# EAGLE design card (EAGLE 6.4)

## Sheet 1 of 2
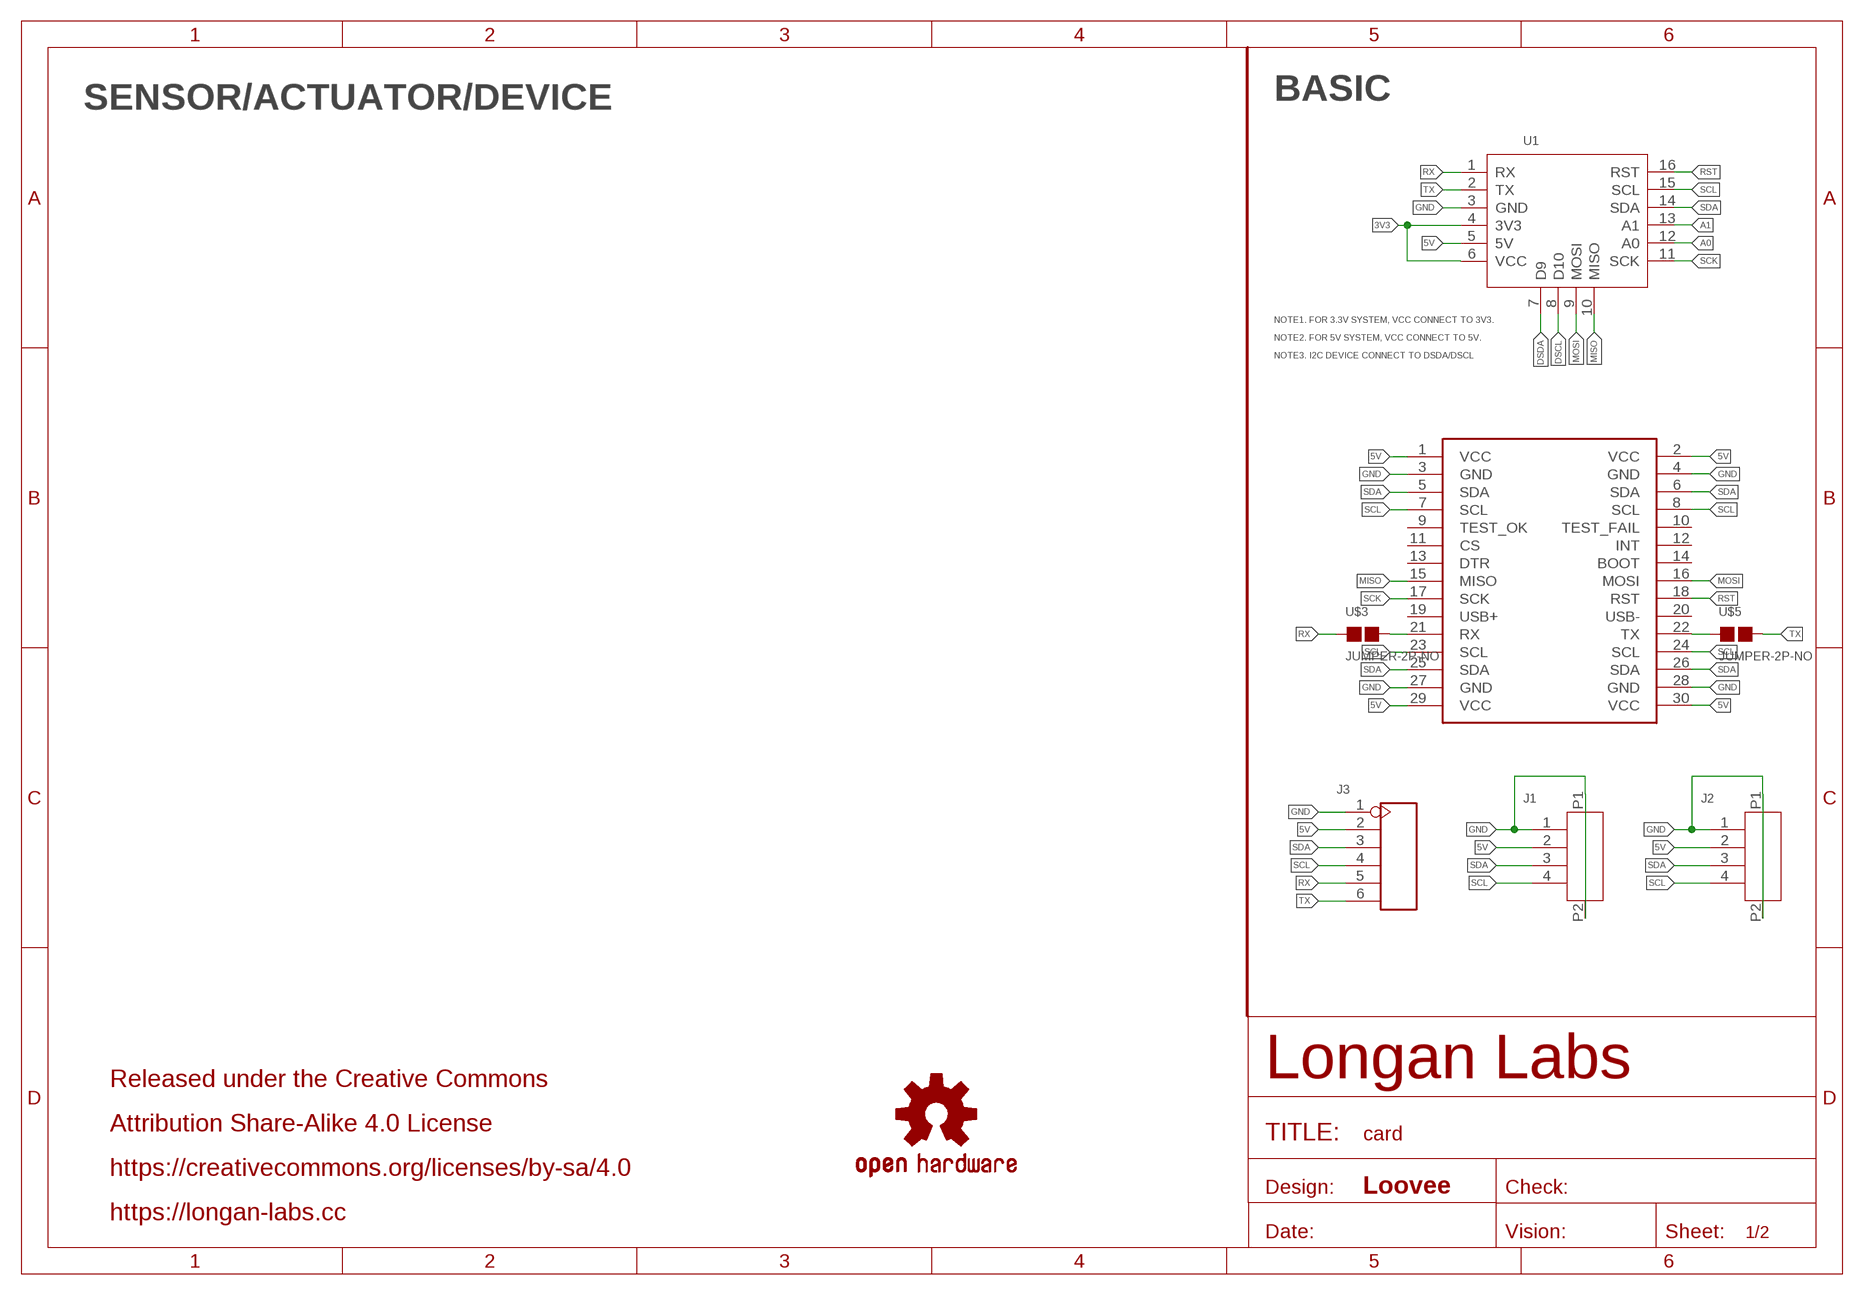
[diagram p0: schematic, sheet 1]

### Parts
J1  HEADER-4P-1.0  [4P-1.0-90D]
J2  HEADER-4P-1.0  [4P-1.0-90D]
J3  HEADER-6P-55/35MIL  [H6-2.54]
LOGO2  OSHW-LOGOS  [OSHW-LOGO-S]
MOUDLE1  MOUDLE-2X15P-2.54'BOARD'  [MOUDLE-2X15P-2.54]
U1  MOUDLE-CARDS  [16P-2.0-CARDS]
U$3  JUMPER-2P-NO  [2P-SMD-NO]
U$5  JUMPER-2P-NO  [2P-SMD-NO]

### Nets
3V3: U1.4(3V3) U1.6(VCC)
5V: J1.2 J2.2 J3.2 MOUDLE1.1(VCC) MOUDLE1.2(VCC) MOUDLE1.29(VCC) MOUDLE1.30(VCC) U1.5(5V)
A0: U1.12(A0)
A1: U1.13(A1)
DSCL: U1.8(D10)
DSDA: U1.7(D9)
GND: J1.1 J1.P1 J1.P2 J2.1 J2.P1 J2.P2 J3.1 MOUDLE1.3(GND) MOUDLE1.4(GND) MOUDLE1.27(GND) MOUDLE1.28(GND) U1.3(GND)
MISO: MOUDLE1.15(MISO) U1.10(MISO)
MOSI: MOUDLE1.16(MOSI) U1.9(MOSI)
N$1: MOUDLE1.21(RX) U$3.2
N$2: MOUDLE1.22(TX) U$5.1
RST: MOUDLE1.18(RST) U1.16(RST)
RX: J3.5 U1.1(RX) U$3.1
SCK: MOUDLE1.17(SCK) U1.11(SCK)
SCL: J1.4 J2.4 J3.4 MOUDLE1.7(SCL) MOUDLE1.8(SCL) MOUDLE1.23(SCL) MOUDLE1.24(SCL) U1.15(SCL)
SDA: J1.3 J2.3 J3.3 MOUDLE1.5(SDA) MOUDLE1.6(SDA) MOUDLE1.25(SDA) MOUDLE1.26(SDA) U1.14(SDA)
TX: J3.6 U1.2(TX) U$5.2
Unconnected: MOUDLE1.9(TEST_OK) MOUDLE1.10(TEST_FAIL) MOUDLE1.11(CS) MOUDLE1.12(INT) MOUDLE1.13(DTR) MOUDLE1.14(BOOT) MOUDLE1.19(USB+) MOUDLE1.20(USB-)

### Notes on the sheet
- SENSOR/ACTUATOR/DEVICE | BASIC
- NOTE1. FOR 3.3V SYSTEM, VCC CONNECT TO 3V3.
- NOTE2. FOR 5V SYSTEM, VCC CONNECT TO 5V.
- NOTE3. I2C DEVICE CONNECT TO DSDA/DSCL
- Released under the Creative Commons
- Attribution Share-Alike 4.0 License
- https://creativecommons.org/licenses/by-sa/4.0
- Loovee
- https://longan-labs.cc

## Sheet 2 of 2

## Library data of the parts
J1 J2 = Longan-Connect:HEADER-4P-1.0
J3 = Connector-new:HEADER-6P
LOGO2 = SparkFun-Aesthetics:OSHW-LOGO: Open-Source Hardware (OSHW) Logo This logo indicates the piece of hardware it is found on incorporates a OSHW license and/or adheres to the definition of open source hardware found here: http://freedomdefined.org/OSHW
MOUDLE1 = Longan-moudle:MOUDLE-2X15P-2.54
U1 = MOUDLE-CARDS:MOUDLE-CARDS
U$3 U$5 = Discrete-new:JUMPER-2P-NO

## Board
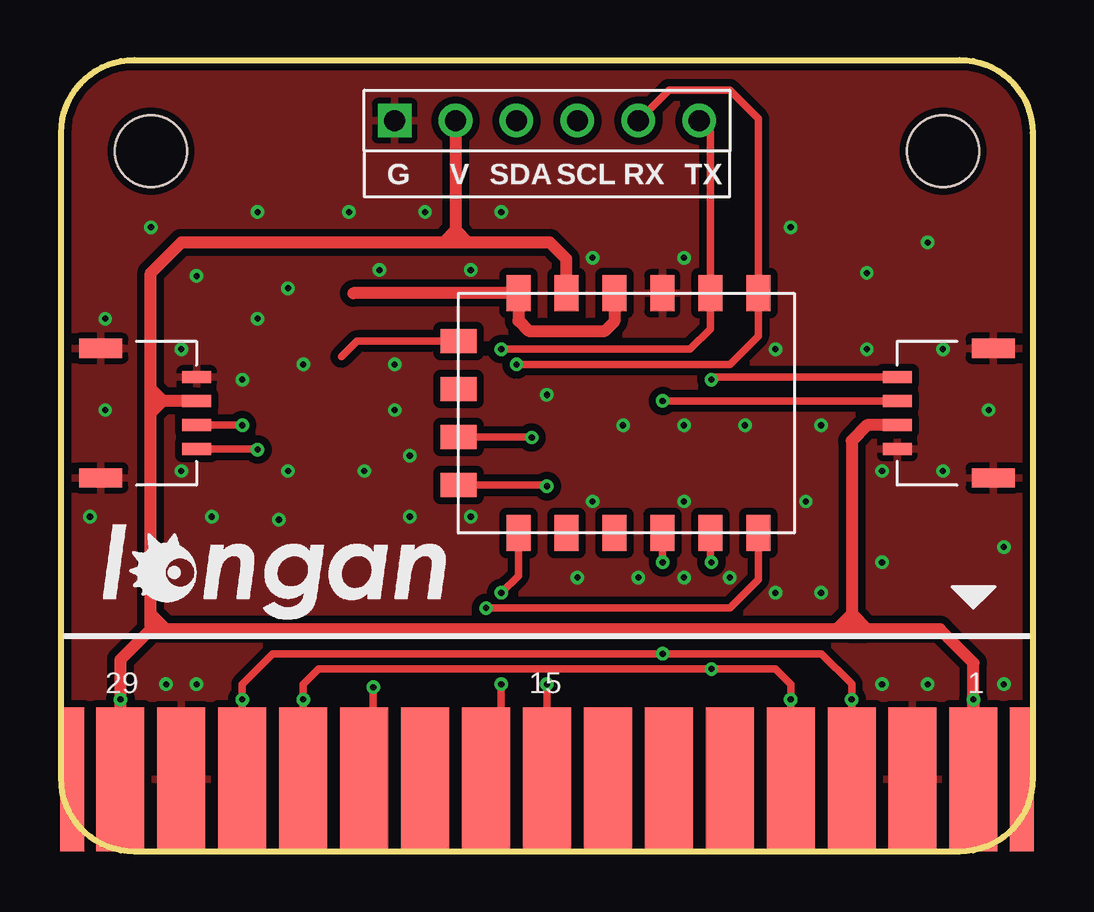
[diagram p1: board, top side]
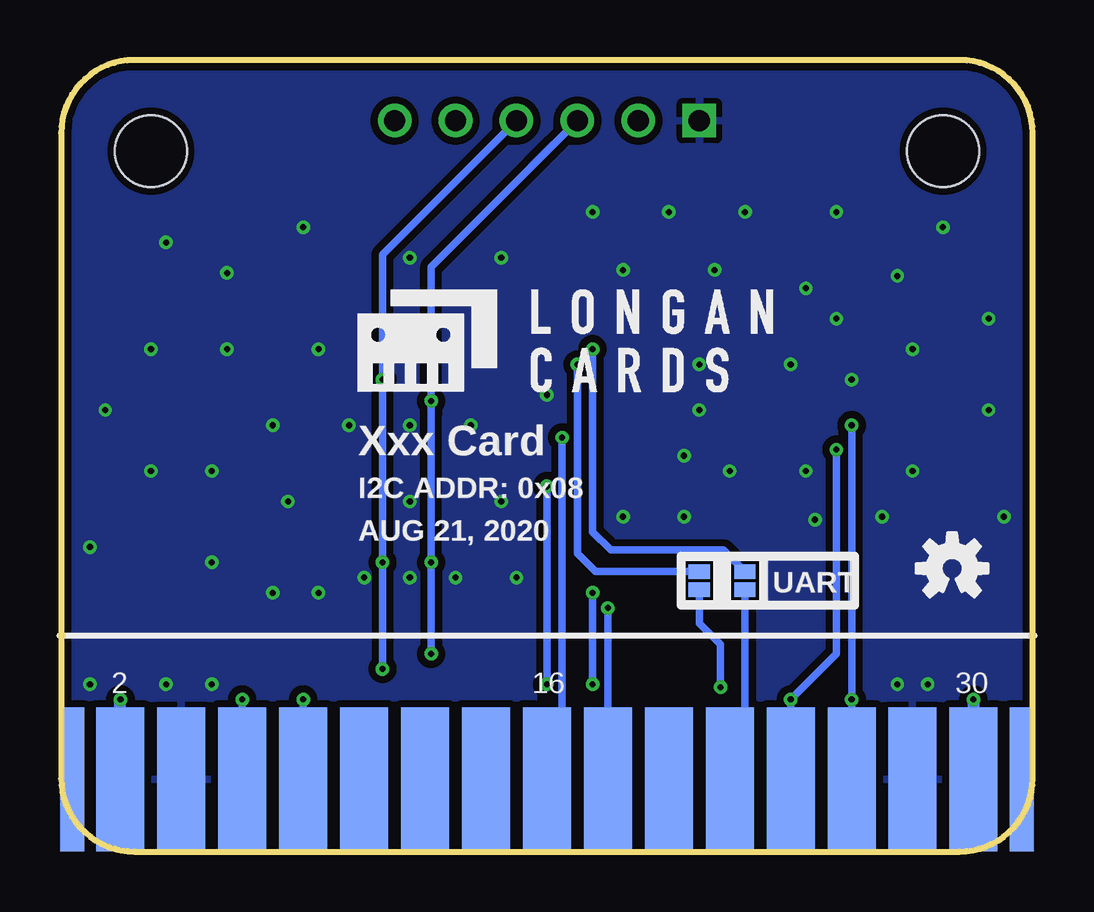
[diagram p2: board, bottom side, seen from below]

Size 40.5 x 33 mm. Coordinates in mm from the lower left corner, seen from the top.
Copper layers (1*16): Top 0.035mm / dielectric 1.5mm / Bottom 0.035mm
Design rules "SeeedStudio_2layer_DRU_no_angle_20140221 *": minimum track width 6mil, minimum drill 10mil, track to track 6mil, track to pad 6mil, pad to pad 6mil, via to via 6mil, smd to smd 0mil, copper to edge 10mil, drill to drill 10mil, minimum pad ring 10mil, minimum via ring 6mil, stop-mask expansion 2mil, vias tented up to drill 25mil, thermal gap 10mil

### Footprints (pad centres in the part's own frame; a part is rotated, then mirrored left to right if it is on the bottom)
4P-1.0-90D = smd 1.2 x 0.5: 1 0,1.5; 2 0,0.5; 3 0,-0.5; 4 0,-1.5 | smd 1.8 x 0.8: P1 -4,2.7; P2 -4,-2.7
H6-2.54 = drill 0.889 pad 1.397 square: 1 0,6.35 | drill 0.889 pad 1.397: 2 0,3.81; 3 0,1.27; 4 0,-1.27; 5 0,-3.81; 6 0,-6.35
MOUDLE-2X15P-2.54 = smd 2 x 6: 1 17.78,-13.492; 3 15.24,-13.492; 5 12.7,-13.492; 7 10.16,-13.492; 9 7.62,-13.492; 11 5.08,-13.492; 13 2.54,-13.492; 15 0,-13.492; 17 -2.54,-13.492; 19 -5.08,-13.492; 21 -7.62,-13.492; 23 -10.16,-13.492; 25 -12.7,-13.492; 27 -15.24,-13.492; 29 -17.78,-13.492 | smd 2 x 6 bottom: 2 17.78,-13.492; 4 15.24,-13.492; 6 12.7,-13.492; 8 10.16,-13.492; 10 7.62,-13.492; 12 5.08,-13.492; 14 2.54,-13.492; 16 0,-13.492; 18 -2.54,-13.492; 20 -5.08,-13.492; 22 -7.62,-13.492; 24 -10.16,-13.492; 26 -12.7,-13.492; 28 -15.24,-13.492; 30 -17.78,-13.492 | smd 1 x 6: P1 -19.8,-13.492; P4 19.8,-13.492 | smd 1 x 6 bottom: P2 -19.8,-13.492; P3 19.8,-13.492 | hole 3: -16.51,12.7; 16.51,12.7
16P-2.0-CARDS = smd 1.5 x 1: 1 -5,5; 2 -5,3; 3 -5,1; 4 -5,-1; 5 -5,-3; 6 -5,-5; 11 5,-5; 12 5,-3; 13 5,-1; 14 5,1; 15 5,3; 16 5,5 | smd 1 x 1.5: 7 -3,-7.5; 8 -1,-7.5; 9 1,-7.5; 10 3,-7.5
2P-SMD-NO = smd 0.889 x 0.61: 1 0,0.381; 2 0,-0.381

### Placement (x,y rotation side)
J1  5.64,18.28 0 top
J2  34.86,18.28 180 top
J3  20.25,30.47 90 top
LOGO2  3.36,11.8 0 bottom
MOUDLE1  20.25,16.5 0 top
U1  24.06,18.28 270 top
U$1  [LONGAN-CARDS-MIDDLE]  28.89,18.66 0 bottom
U$2  [LONGAN-SILK-SMALLER]  0.44,8.5 0 top
U$3  13.9,11.29 0 bottom
U$5  11.99,11.29 180 bottom

### Tracks (layer width: path | path; a pad name or v marks a point on that pad's centre or on a via)
3V3
  Top 0.508: 12.17,23.28 U1.6 19.06,22.13 19.49,21.71 22.66,21.71 23.06,22.1 U1.4
5V  (via drill 0.25 pad 0.51)
  Top 0.508: v38.03,6.34 MOUDLE1.2 38.03,7.86 36.63,9.26 33.59,9.26 | 32.82,9.26 32.31,9.26 | 32.31,9.26 5.01,9.26 4.38,9.26 | 4.38,9.26 3.74,9.26 | 3.74,9.26 2.47,7.99 v2.47,6.34 MOUDLE1.30 | 3.74,9.26 3.74,9.9 | 3.74,9.9 3.74,18.28 | 3.74,18.28 3.74,18.79 | J1.2 4.26,18.78 | 4.24,18.78 3.75,18.78 3.74,18.79 | U1.5 21.06,24.71 20.38,25.39 16.95,25.39 | 16.95,25.39 16.44,25.39 | 16.44,25.39 15.93,25.39 | 15.93,25.39 5.01,25.39 3.74,24.12 3.74,19.29 | 3.74,18.79 3.74,19.29 | J3.2 16.44,25.9 | 16.44,25.9 16.44,25.39 | J2.2 33.59,17.78 32.95,17.14 32.95,9.9 | 32.95,9.9 32.95,9.39 32.82,9.26 | 4.26,18.78 3.74,19.29 | 4.26,18.78 4.24,18.78 | 4.24,18.78 3.74,18.28 | 16.44,25.9 16.95,25.39 | 16.44,25.9 15.93,25.39 | 32.95,9.9 33.59,9.26 | 32.95,9.9 32.31,9.26 | 32.82,9.26 33.59,9.26 | 4.38,9.26 3.74,9.9
  Bottom 0.508: MOUDLE1.2 v38.03,6.34 | v2.47,6.34 MOUDLE1.30
DSDA
  Top 0.305: U1.7 12.33,21.28 11.69,20.63
GND  (via drill 0.25 pad 0.51)
  other vias: 4.38,6.97 5.64,6.97 34.22,6.97 36.12,6.97 21.52,11.42 24.06,11.42 25.96,11.42 27.87,11.42 29.77,10.79 31.68,10.79 38.66,18.41 36.76,15.87 36.76,20.95 31.68,17.77 28.51,17.77 25.96,17.77 23.43,17.77 25.96,14.6 22.16,14.6 31.05,14.6 20.25,19.04 13.9,20.31 12.63,15.87 13.9,18.41 9.46,15.87 9.07,13.83 14.54,13.96 17.07,13.96 14.54,16.5 7.55,19.68 10.09,20.31 17.07,24.25 13.27,24.25 9.46,23.48 8.19,22.21 5.01,20.95 5.01,15.87 1.84,18.41 1.84,22.21 1.2,13.96 6.28,13.96 5.64,23.99 3.74,26.02 8.19,26.66 15.17,26.66 11.99,26.66 18.34,26.66 22.16,24.76 25.96,24.76 29.77,20.95 33.59,20.95 30.41,26.02 36.12,25.39 33.59,24.12 34.22,12.05 39.3,12.69 34.22,15.87 39.3,6.97
  pour Bottom (isolate 0.305): -0.07,33.01 40.57,33.01 40.57,-0.01 -0.07,-0.01
  pour Top (isolate 0.305): -0.07,33.01 40.57,33.01 40.57,-0.01 -0.07,-0.01
MISO  (via drill 0.25 pad 0.51)
  Top 0.305: U1.10 20.2,15.28 v20.25,15.23 | v20.25,6.97 MOUDLE1.15
  Bottom 0.305: v20.25,15.23 v20.25,6.97
MOSI  (via drill 0.25 pad 0.51)
  Top 0.305: U1.9 19.6,17.28 v19.61,17.26
  Bottom 0.305: v19.61,17.26 19.61,3.64 MOUDLE1.16
N$1  (via drill 0.25 pad 0.51)
  Top 0.305: v13.01,6.85 13.01,2.66 12.63,2.28 MOUDLE1.21
  Bottom 0.305: U$3.2 13.9,9.52 13.01,8.63 v13.01,6.85
N$2
  Bottom 0.305: U$5.1 11.99,3.64 MOUDLE1.22
RST  (via drill 0.25 pad 0.51)
  Top 0.305: U1.16 29.06,11.34 27.87,10.15 v17.71,10.15
  Bottom 0.305: v17.71,10.15 MOUDLE1.18
RX  (via drill 0.25 pad 0.51)
  Top 0.305: J3.5 25.33,31.74 27.87,31.74 29.06,30.55 U1.1 29.06,21.5 27.87,20.31 v18.98,20.31
  Bottom 0.305: v18.98,20.31 18.98,12.44 18.22,11.67 U$3.1
SCK  (via drill 0.25 pad 0.51)
  Top 0.305: U1.11 19.06,11.5 v18.34,10.79 | v18.34,6.97 18.34,3.64 MOUDLE1.17
  Bottom 0.305: v18.34,10.79 v18.34,6.97
SCL  (via drill 0.25 pad 0.51)
  Top 0.305: MOUDLE1.8 v30.41,6.34 30.41,6.97 29.77,7.61 v27.11,7.61 10.72,7.61 10.09,6.97 v10.09,6.34 MOUDLE1.23 | U1.15 27.06,12.1 v27.11,12.05 | J1.4 8.16,16.78 v8.19,16.75 | J2.4 27.21,19.78 v27.11,19.68
  Bottom 0.305: MOUDLE1.23 v10.09,6.34 8.19,8.24 v8.19,16.75 | v30.41,6.34 MOUDLE1.8 | v27.11,7.61 v27.11,12.05 27.11,19.17 v27.11,19.68 27.11,24.88 J3.4
SDA  (via drill 0.25 pad 0.51)
  Top 0.305: MOUDLE1.6 v32.95,6.34 32.95,6.99 31.69,8.24 v25.08,8.24 8.82,8.24 7.55,6.97 v7.55,6.34 MOUDLE1.25 | U1.14 25.06,12.07 v25.08,12.05 | J1.3 v7.54,17.78 v7.55,17.77 | J2.3 25.08,18.78 v25.08,18.79
  Bottom 0.305: MOUDLE1.6 v32.95,6.34 | MOUDLE1.25 v7.55,6.34 v7.55,17.77 | v25.08,8.24 v25.08,12.05 25.08,18.28 v25.08,18.79 25.08,24.37 J3.3 20.89,28.56
TX  (via drill 0.25 pad 0.51)
  Top 0.305: J3.6 27.06,30.01 U1.2 27.06,21.79 26.22,20.95 v18.34,20.95
  Bottom 0.305: v18.34,20.95 18.34,13.32 17.58,12.56 12.88,12.56 U$5.2

### Text on the board
tPlace: G | V | SDA | SCL | RX | TX
bPlace: Xxx Card | I2C ADDR: 0x08 | AUG 21, 2020 | UART